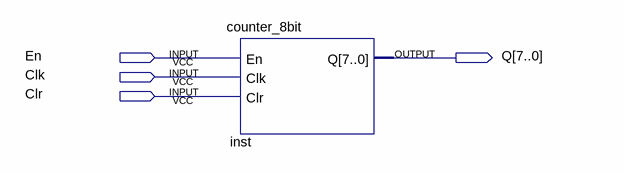
[diagram p0: schematic sheet]
// Quartus schematic Lab4Part1.bdf as structural Verilog: 1 symbols, 4 pins
module Lab4Part1 (
  input  En,
  input  Clk,
  input  Clr,
  output [7:0] Q
);

  counter_8bit inst (.En(En), .Clk(Clk), .Clr(Clr), .Q(Q));
endmodule
